# EasyEDA Pro project ProProject_MinSyBo_Star_2024-06-01.epro

# Schematic 原理图

## Sheets
1 P1: Create Date: 2024-05-13; Page Name: P1; Project Name: MinSyBo_Star; Schematic Name: 原理图; Update Date: 2024-05-19; Company: 嘉立创EDA; Drawed: DY; Page Size: A4; Version: V1.0
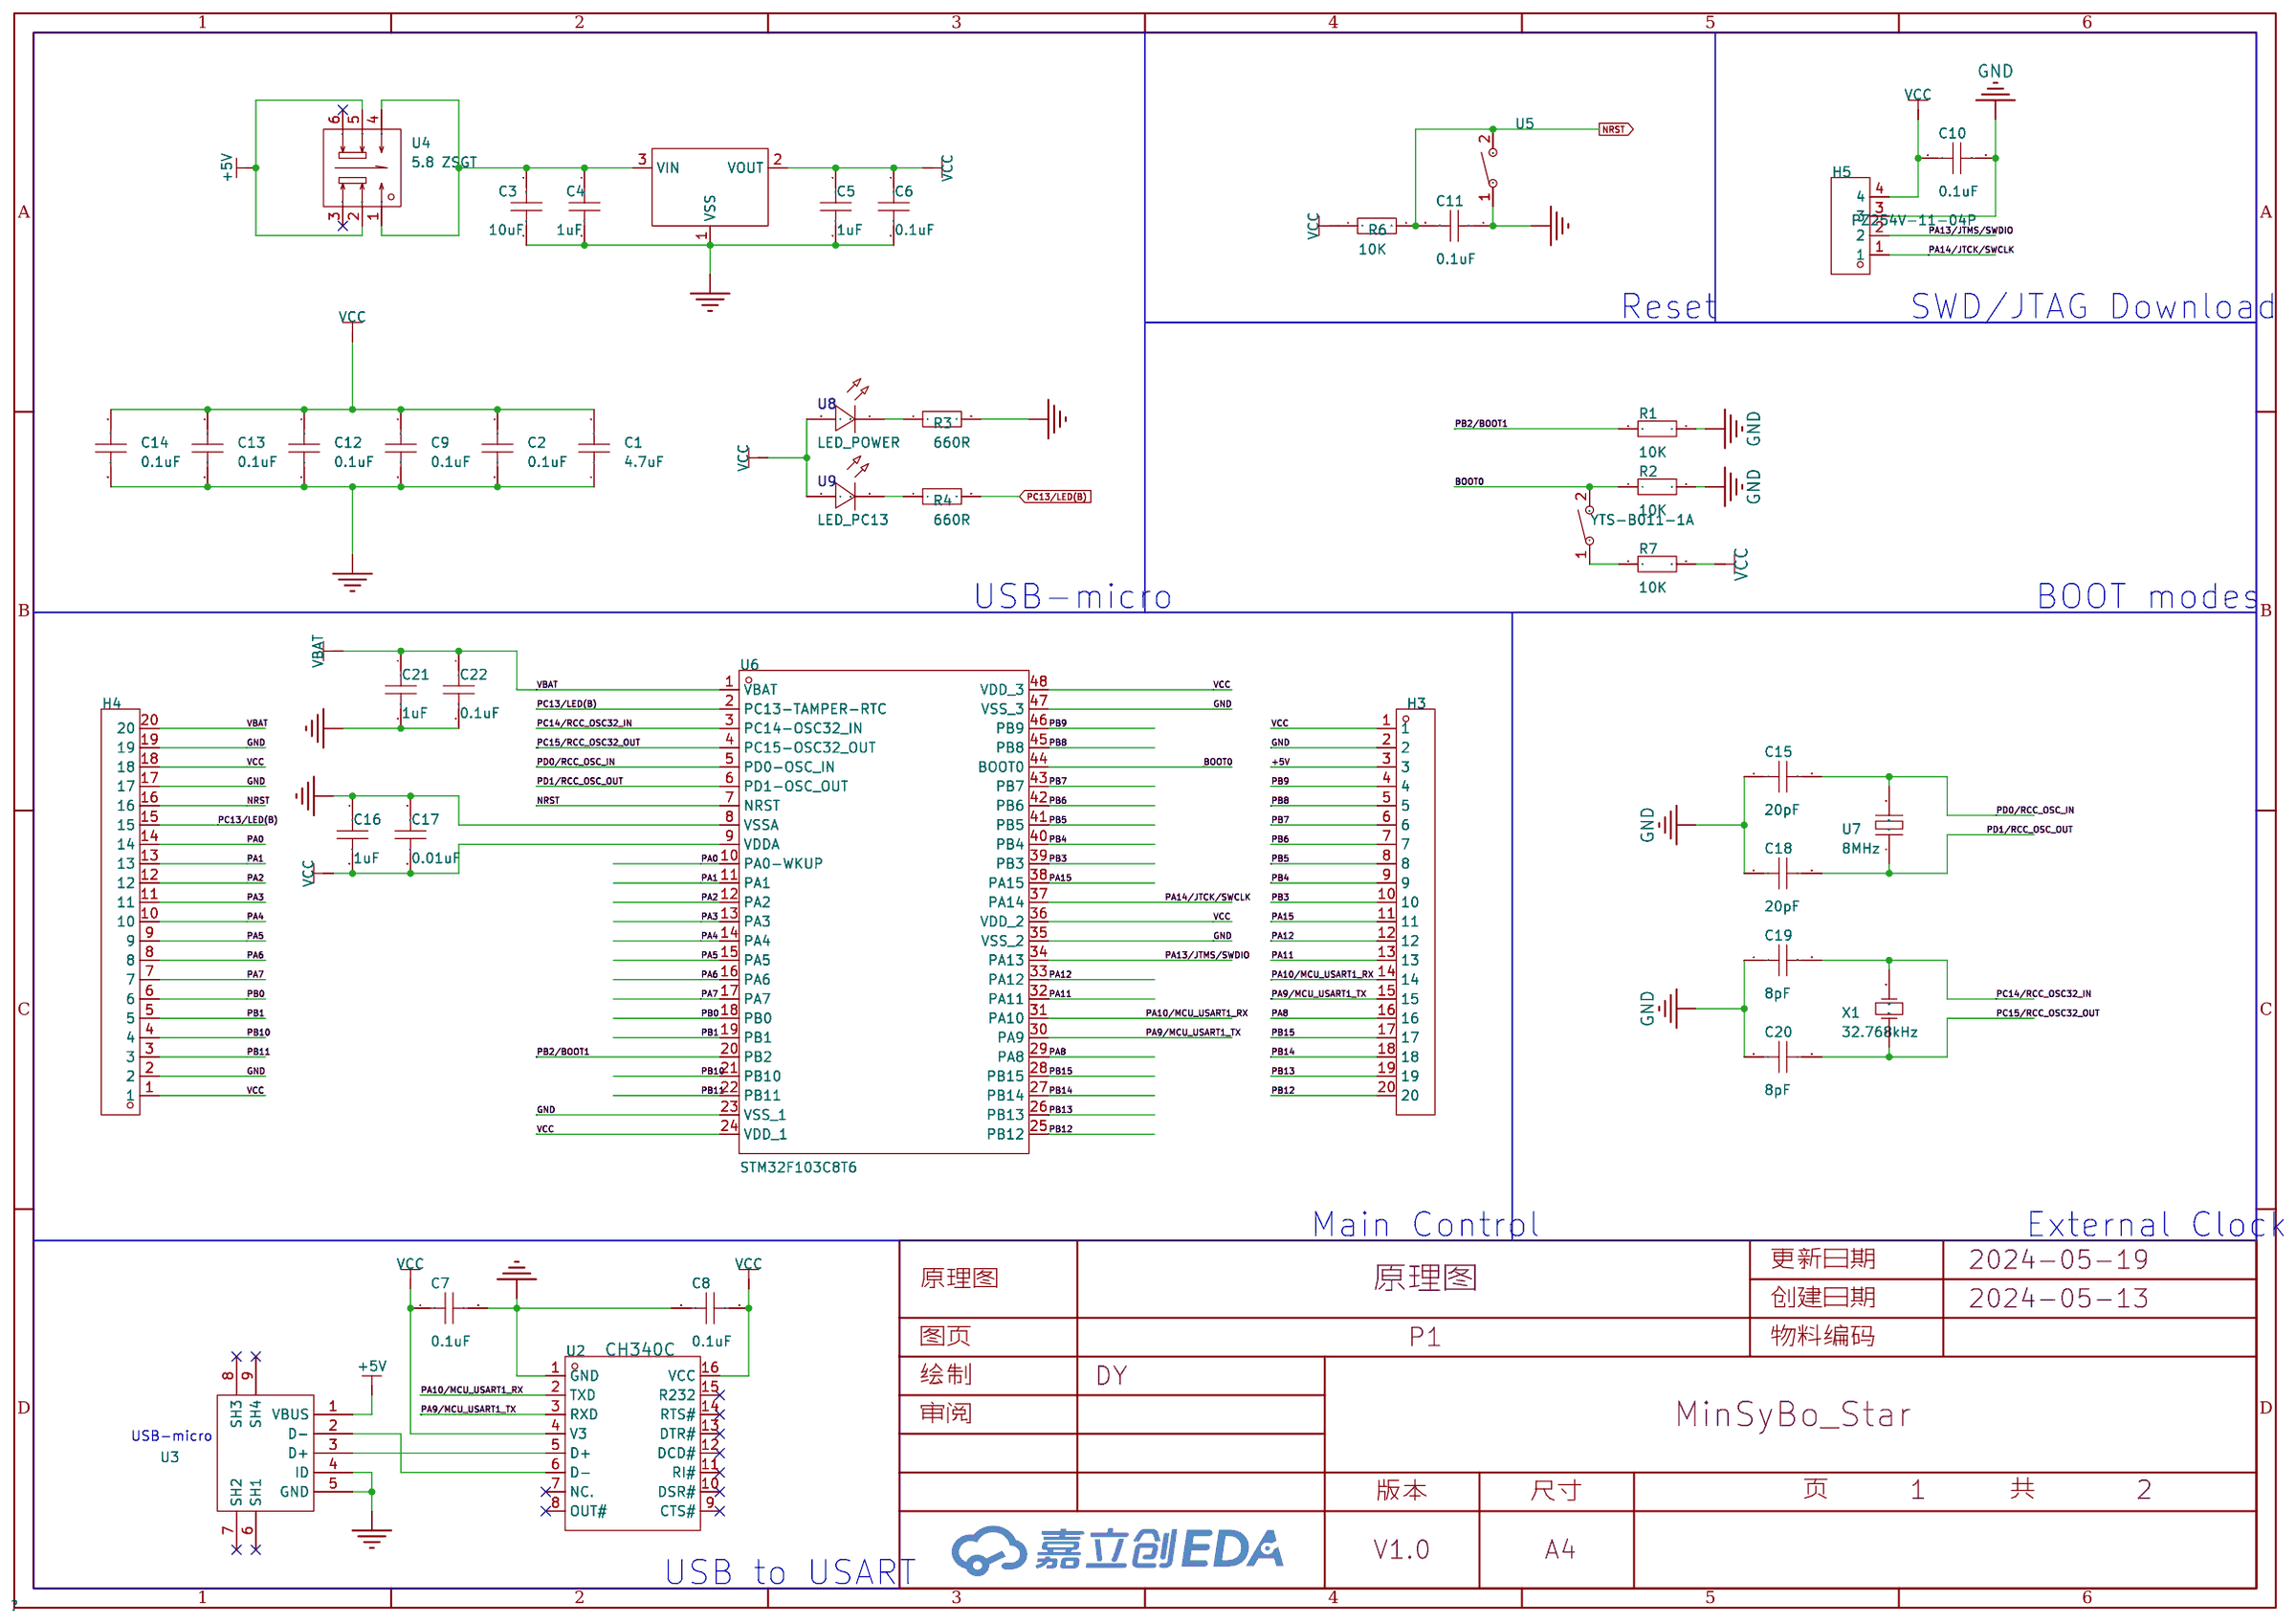
[diagram p0: P1]
2 杂七杂八: Create Date: 2024-05-19; Page Name: 杂七杂八
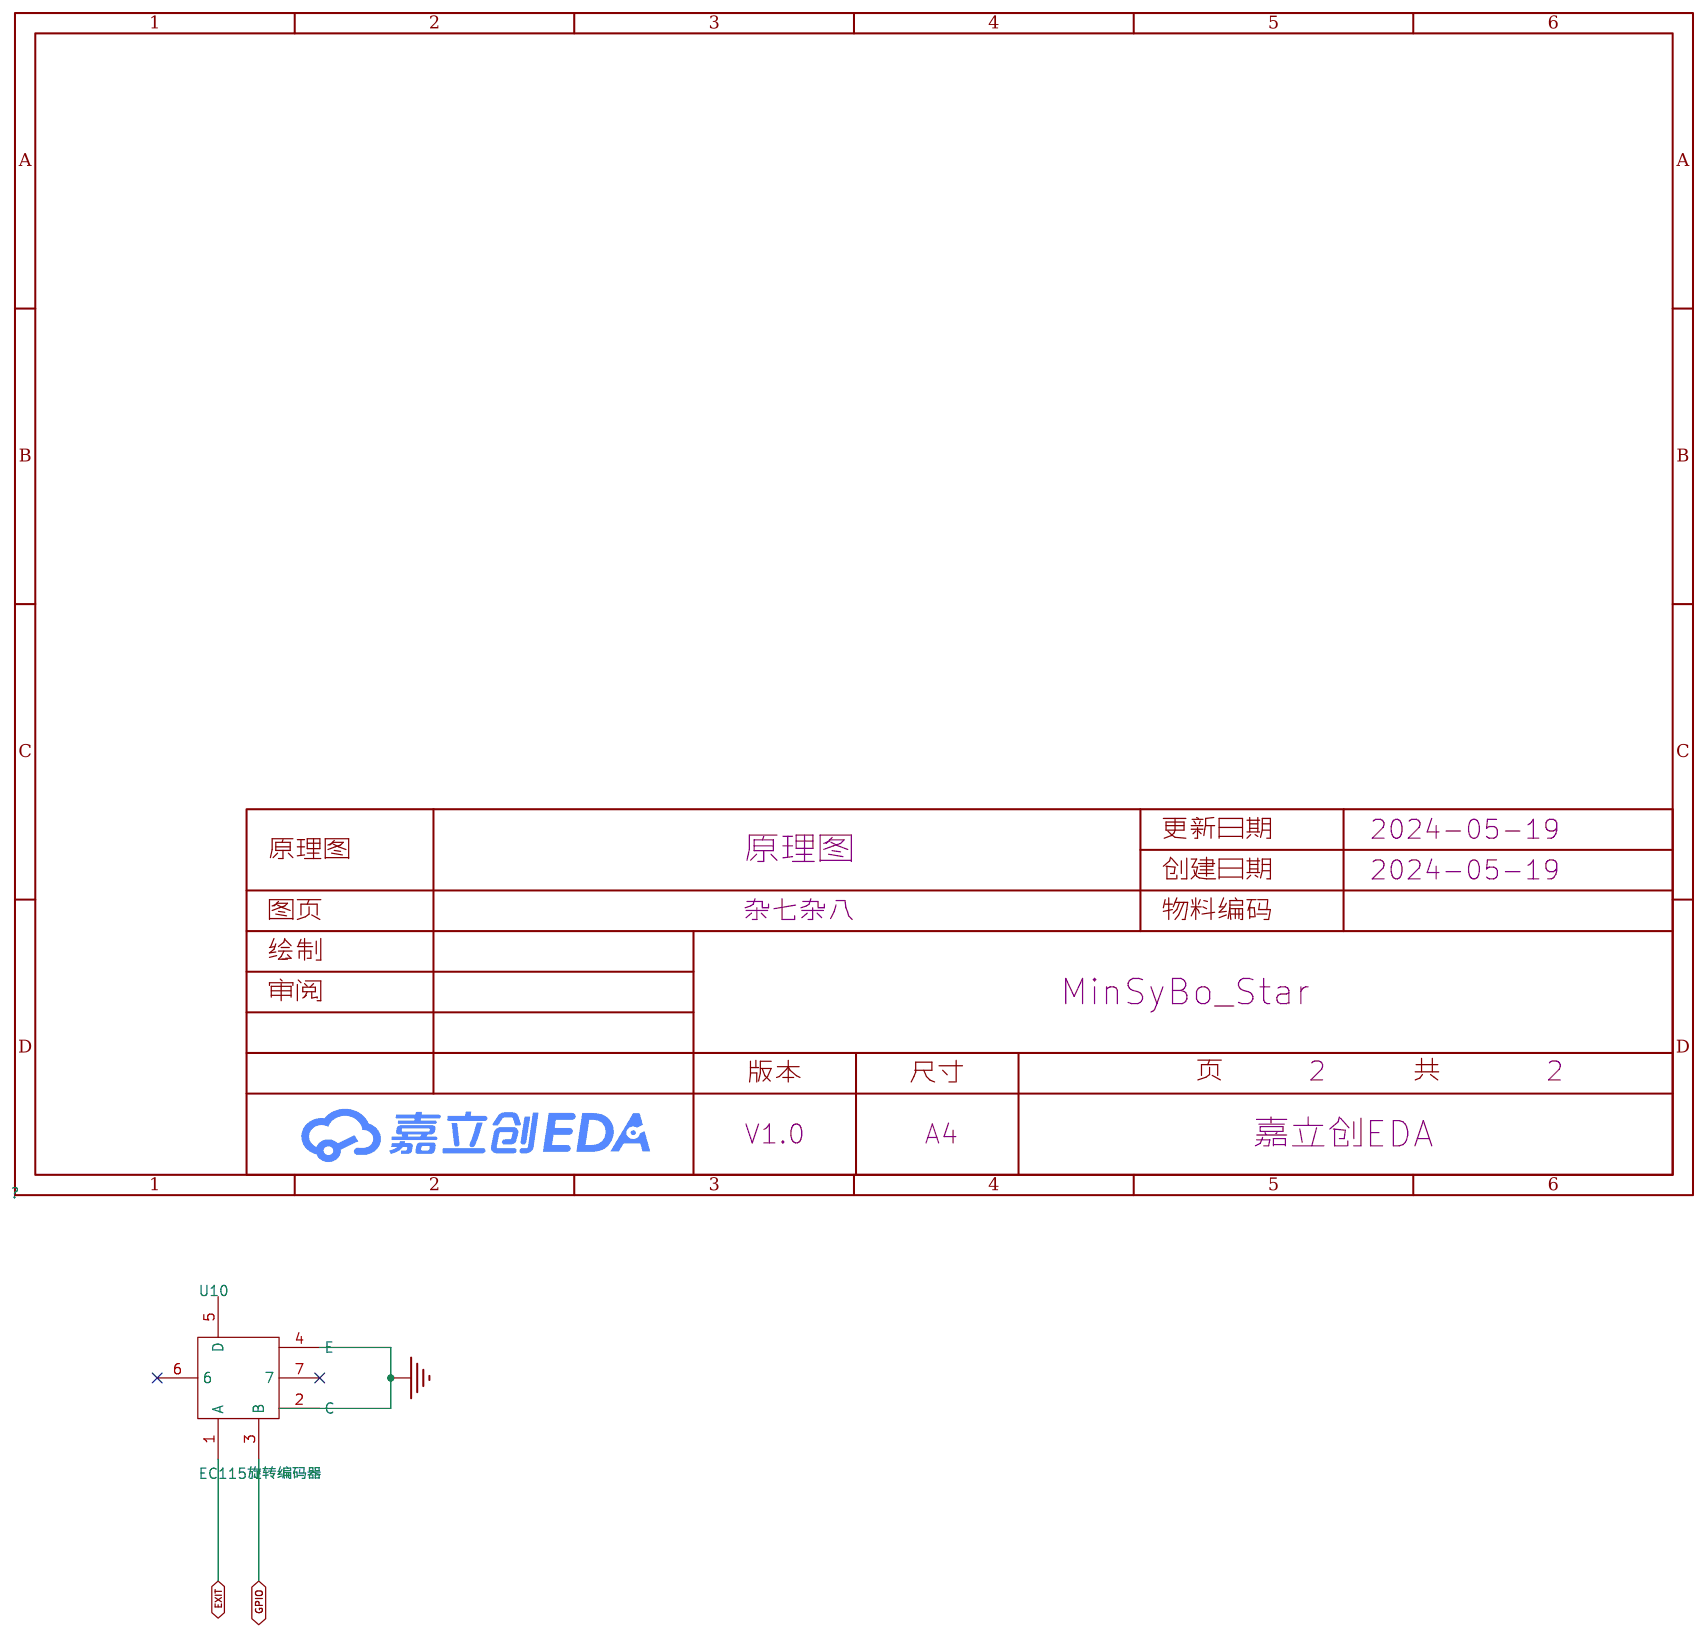
[diagram p1: 杂七杂八]

## Parts
sheet P1
BOOT0  YTS-B011-1A  [SW-TH_L6.1-W3.5-P6.60-LS8.0]
C1  4.7uF  [C0603]
C2  100nF  [C0603]
C3  10uF  [C0603]
C4  1uF  [C0603]
C5  1uF  [C0603]
C6  0.1uF  [C0603]
C7  0.1uF  [C0603]
C8  0.1uF  [C0603]
C9  100nF  [C0603]
C10  0.1uF  [C0603]
C11  0.1uF  [C0603]
C12  100nF  [C0603]
C13  100nF  [C0603]
C14  100nF  [C0603]
C15  20pF  [C0603]
C16  1uF  [C0603]
C17  0.01uF  [C0603]
C18  20pF  [C0603]
C19  8pF  [C0603]
C20  8pF  [C0603]
C21  1uF  [C0603]
C22  0.1uF  [C0603]
H3  2.54-1*20P直针  [HDR-TH_20P-P2.54-V-M-1]
H4  2.54-1*20P直针  [HDR-TH_20P-P2.54-V-M-1]
H5  PZ254V-11-04P  [HDR-TH_4P-P2.54-V-M]
R1  10K  [R0603]
R2  10K  [R0603]
R3  660R  [R0603]
R4  660R  [R0603]
R6  10K  [R0603]
R7  10K  [R0603]
U1  XC6206P332MR  [SOT-23-3_L2.9-W1.3-P1.90-LS2.4-BR]
U2  CH340C  [SOP-16_L10.0-W3.9-P1.27-LS6.0-BL]
U3  MicroXNJ  [MICRO-USB-SMD_MICROXNJ]
U4  5.8 ZSGT  [SW-TH_5.8ZSGT]
U5  YTS-B011-1A  [SW-TH_L6.1-W3.5-P6.60-LS8.0]
U6  STM32F103C8T6  [LQFP-48_L7.0-W7.0-P0.50-LS9.0-BL]
U7  8MHz  [HC-49SMD_L11.1-W4.8]
U8  LED_POWER  [LED_0603]
U9  LED_PC13  [LED_0603]
X1  32.768kHz  [OSC-TH_BD3.8-P0.50]
sheet 杂七杂八
U10  EC115旋转编码器  [SW-SMD_EC115_C9900036245]

## Library data of the parts
BOOT0 = YTS-B011-1A: 电路结构:单刀单掷;按钮形状:矩形按钮;作用力:160gf;安装方式:直插;开关长度:6.1mm;开关宽度:3.5mm;开关高度:4.3mm;带支架:不带;触点电流:50mA;额定电压(DC):12V;绝缘电阻:100MΩ;机械寿命:2万次;; LCSC Part Name: 6.1*3.5*4.3mm 直插 轻触开关; Supplier Part: C2910713; Manufacturer: YIYUAN(怡远); Supplier Footprint: 插件; JLCPCB Part Class: Extended Part; Datasheet: https://atta.szlcsc.com/upload/public/pdf/source/20211129/E22FC470A581AB3D8D68C2E6E06A2474.pdf; Supplier: LCSC; Circuit: 单刀单掷; Actuator Style: 矩形按钮; Operating Force: 160gf; Mounting Style: 直插; Switch Length: 6.1mm; Switch Width: 3.5mm; Switch Height: 4.3mm; Strike Gundam: 不带; Contact Current: 50mA; Voltage Rating (DC): 12V; Insulation Resistance: 100MΩ; Actuator/Cap Color: 白色; Pin Style: PC引脚; Mechanical Life: 2万次; With Lamp: 无; Operating Temperature: -30℃~+85℃
C1 C2 C4-C22 = CAP_0603: Supplier Footprint: 0603; Standardization Check: false; Supplier Part: C14663
C3 = CL10A106KP8NNNC: 容值:10uF;精度:±10%;额定电压:10V;材质(温度系数):X5R;; LCSC Part Name: 10uF ±10% 10V; Supplier Part: C14663; Manufacturer: SAMSUNG(三星); Supplier Footprint: 0603; JLCPCB Part Class: Basic Part; Datasheet: https://atta.szlcsc.com/upload/public/pdf/source/20160218/1457707763339.pdf; Supplier: LCSC; Tolerance: ±10%; Voltage Rated: 10V; Temperature Coefficient: X5R
H3 H4 = 2.54-1*20P直针: 插针结构:1x20P;间距:2.54mm;行距:-;圆针/方针:方针;安装类型:直插;排数:单排;总PIN位数:20P;额定电流:3A;额定电压:-;配合针长度:-;塑高:-;端接针长度:-;触头材质:黄铜;触头镀层:-;工作温度范围:-40℃~+105℃;颜色:黑色;; LCSC Part Name: 间距:2.54mm 1x20P 直插 方针; Supplier Part: C50981; Manufacturer: BOOMELE(博穆精密); Supplier Footprint: 插件,P=2.54mm; JLCPCB Part Class: Extended Part; Datasheet: https://atta.szlcsc.com/upload/public/pdf/source/20151109/1457707572883.pdf; Supplier: LCSC; Pin Structure: 1x20P; Pitch: 2.54mm; Circluar Pins/Square Pins: 方针; Mounting Type: 直插; Number of Rows: 单排; Number of Pins: 20P; Current Rating (Max): 3A; Contact Material: 黄铜; Operating Temperature Range: -40℃~+105℃; Color: 黑色
H5 = PZ254V-11-04P_C492403: 插针结构:1x4P;间距:2.54mm;行距:-;圆针/方针:方针;安装类型:直插;排数:单排;总PIN位数:4P;额定电流:-;额定电压:-;配合针长度:6mm;塑高:2.5mm;端接针长度:3mm;触头材质:黄铜;触头镀层:-;工作温度范围:-40℃~+105℃;颜色:黑色;; LCSC Part Name: 间距:2.54mm 1x4P 直插 方针; Supplier Part: C492403; Manufacturer: XFCN(兴飞); Supplier Footprint: 插件,P=2.54mm; JLCPCB Part Class: Extended Part; Datasheet: https://atta.szlcsc.com/upload/public/pdf/source/20200309/C492403_F9F19131791D08044AD4F84F8E751A34.pdf; Supplier: LCSC; Pin Structure: 1x4P; Pitch: 2.54mm; Circluar Pins/Square Pins: 方针; Mounting Type: 直插; Number of Rows: 单排; Number of Pins: 4P; Length of Mating Pin: 6mm; Insulation Height: 2.5mm; Length of End Connection Pin: 3mm; Contact Material: 黄铜; Operating Temperature Range: -40℃~+105℃; Color: 黑色
R1 R2 R6 R7 = Res_0603: Supplier Footprint: 0603; Standardization Check: false; Supplier Part: C23025
R3 R4 = Res_0603: Supplier Footprint: 0603; Supplier Part: C23025
U1 = XC6206P332MR_C5148692: 输出类型:固定;最大输入电压:8V;输出电压:3.3V;最大输出电流:300mA;输出极性:正极;; LCSC Part Name: 输入8V 输出3.3V 300mA; Supplier Part: C5148692; Manufacturer: HXY MOSFET(华轩阳电子); Supplier Footprint: SOT-23; JLCPCB Part Class: 扩展库; Datasheet: https://atta.szlcsc.com/upload/public/pdf/source/20230315/7D5B35EFFBBF81C2EFC36318D2A1A670.pdf; Supplier: LCSC; Output Type: 固定; Maximum Input Voltage: 8V; Output Voltage: 3.3V; MAX Output Current: 300mA; Dropout Voltage: 240mV@(50mA); Output Polarity: 正极; Number of Outputs: 1
U2 = CH340C: 应用功能:收发器;接口协议:USB 2.0;数据速率:2Mbps;; LCSC Part Name: CH340C USB转串口芯片 CH340; Supplier Part: C84681; Manufacturer: WCH(南京沁恒); Supplier Footprint: SOP-16; Datasheet: https://atta.szlcsc.com/upload/public/pdf/source/20200819/C84681_ADBED554CE321879DBD6B1D06488689C.pdf; Supplier: LCSC; Applications Function: 收发器; Protocol: USB 2.0; Supply Voltage: 3.3V；5V; Data Rate: 2Mbps
U3 = MicroXNJ: 连接器类型:Micro-B;标准:USB 2.0;公母:母;端口数量:1;触点数量:5P;安装方式:卧贴;额定电流 - 电源:1A;工作温度范围:-20℃~+85℃;; LCSC Part Name: Micro-B 母 卧贴; Supplier Part: C404969; Manufacturer: SHOU HAN(首韩); Supplier Footprint: SMD; JLCPCB Part Class: Extended Part; Datasheet: https://atta.szlcsc.com/upload/public/pdf/source/20220415/2494EDFF499AF6F852F7C820374B6AF3.pdf; Supplier: LCSC; Connector Type: Micro-B; Standard: USB 2.0; Gender: 母; Number of Ports: 1; Number of Contacts: 5P; Mounting Style: 卧贴; Current Rating - Power (Max): 1A; Operating Temperature Range: -20℃~+85℃
U4 = 5.8 ZSGT: 电路结构:双刀双掷;自锁/无锁:自锁;安装方式:直插;触点电流:110mA;额定电压 (DC):30V;带灯:不带;作用力:150gf;机械寿命:10万次;; LCSC Part Name: 5.8*5.8有头/高头 带锁/自锁开关 泡泡机开关; Supplier Part: C2681587; Manufacturer: SHOU HAN(首韩); Supplier Footprint: 插件; JLCPCB Part Class: 扩展库; Datasheet: https://atta.szlcsc.com/upload/public/pdf/source/20210107/C2681587_CDDDDA4A1C7AC9FEB01815B75893A6BA.pdf; Supplier: LCSC; Circuit: 双刀双掷; Self Lock / No Lock: 自锁; Actuator Style: 方形按钮; Mounting Style: 直插; Contact Current: 110mA; Voltage Rating (DC): 30V; Insulation Resistance: 100MΩ; Actuator/Cap Color: 白色; With Lamp: 不带; Pin Style: PC引脚; Operating Force: 150gf; Operating Temperature: -10℃~+70℃; Mechanical Life: 10万次
U5 = YTS-B011-1A: 电路结构:单刀单掷;按钮形状:矩形按钮;作用力:160gf;安装方式:直插;开关长度:6.1mm;开关宽度:3.5mm;开关高度:4.3mm;带支架:不带;触点电流:50mA;额定电压(DC):12V;绝缘电阻:100MΩ;机械寿命:2万次;; LCSC Part Name: 6.1*3.5*4.3mm 直插 轻触开关; Supplier Part: C2910713; Manufacturer: YIYUAN(怡远); Supplier Footprint: 插件; JLCPCB Part Class: Extended Part; Datasheet: https://atta.szlcsc.com/upload/public/pdf/source/20211129/E22FC470A581AB3D8D68C2E6E06A2474.pdf; Supplier: LCSC; Circuit: 单刀单掷; Actuator Style: 矩形按钮; Operating Force: 160gf; Mounting Style: 直插; Switch Length: 6.1mm; Switch Width: 3.5mm; Switch Height: 4.3mm; Strike Gundam: 不带; Contact Current: 50mA; Voltage Rating (DC): 12V; Insulation Resistance: 100MΩ; Actuator/Cap Color: 白色; Pin Style: PC引脚; Mechanical Life: 2万次
U6 = STM32F103C8T6: CPU内核:ARM-M3;程序存储容量:64KB;RAM总容量:20KB;GPIO端口数量:37;工作电压范围:2V~3.6V;CPU最大主频:72MHz;程序存储器类型:FLASH;; Supplier Part: C8734; Manufacturer: ST(意法半导体); Supplier Footprint: LQFP-48(7x7); JLCPCB Part Class: 扩展库; Datasheet: https://atta.szlcsc.com/upload/public/pdf/source/20220812/8363ACEC51AD55ECEB84799464F7CB85.pdf; Supplier: LCSC; CPU Core: ARM-M3; Program Storage Size: 64KB; RAM Size: 20KB; GPIO Ports Number: 37; Operating Voltage Range: 2V~3.6V; CPU Maximum Speed: 72MHz; Program Memory Type: FLASH; Operating Temperature Range: -40℃~+85℃; ADC (Bit): 12bit; Universal Serial Bus: 有; Peripheral/Function: 看门狗；DMA；看门狗；温度传感器; Watchdog: 有; Infrared Data Association: 有; Low-Voltage Detect: 有; Direct Memory Access: 有; Internal Oscillator: 有
U7 = RC08000619: 晶振类型:贴片晶振;频率:8MHz;常温频差:±10ppm;外接负载电容:20pF;频率稳定度(全温):±30ppm;; LCSC Part Name: 8MHz ±10ppm 20pF; Supplier Part: C19173024; Manufacturer: TROQ(创捷); Supplier Footprint: HC-49S-SMD; Datasheet: https://atta.szlcsc.com/upload/public/pdf/source/20231030/EE638514B404DA0C4D347D745AEBACA1.pdf; Supplier: LCSC; Crystal Type: 贴片晶振; Normal temperature Frequency Tolerance: ±10ppm; External load capacitor: 20pF; Frequency Stability(Full temperature range): ±30ppm; Operating Temperature: -40℃~+85℃
U8 = LED_0603-G: Supplier Footprint: 0603; Supplier Part: C965799
U9 = LED_0603-B: Supplier Footprint: 0603; Supplier Part: C965799
X1 = K383276812520: 晶振类型:直插晶振;频率:32.768kHz;常温频差:±20ppm;外接负载电容:12.5pF;频率稳定度(全温):±20ppm;; LCSC Part Name: 32.768kHz ±20ppm 12.5pF; Supplier Part: C368795; Manufacturer: KYX(凯越翔); Supplier Footprint: DT-38; Datasheet: https://atta.szlcsc.com/upload/public/pdf/source/20190218/C368795_B0303523B118954B279FF456DC2D6212.pdf; Supplier: LCSC; Crystal Type: 直插晶振; Normal temperature Frequency Tolerance: ±20ppm; External load capacitor: 12.5pF; Frequency Stability(Full temperature range): ±20ppm; Equivalent Series Resistance (ESR): 70kΩ; Operating Temperature: -20℃~+70℃
U10 = EC115旋转编码器: Supplier Part: C9900036245; Supplier Footprint: SMD; JLCPCB Part Class: 扩展库; Supplier: LCSC

## Nets
+5V: H3.3 U3.1(VBUS) U4.2 U4.5
GND: C1.1 C2.2 C3.2 C4.2 C5.2 C6.2 C7.2 C8.1 C9.2 C10.2 C11.1 C12.2 C13.2 C14.2 C15.1 C16.1 C17.1 C18.1 C19.1 C20.1 C21.2 C22.2 H3.2 H4.2 H4.17 H4.19 H5.3 R1.1 R2.2 R3.2 U1.1(VSS) U2.1(GND) U3.4(ID) U3.5(GND) U5.1 U6.8(VSSA) U6.23(VSS_1) U6.35(VSS_2) U6.47(VSS_3) U10.2(C)
VBAT: C21.1 C22.1 H4.20 U6.1(VBAT)
VCC: C1.2 C2.1 C5.1 C6.1 C7.1 C8.2 C9.1 C10.1 C12.1 C13.1 C14.1 C16.2 C17.2 H3.1 H4.1 H4.18 H5.4 R6.1 R7.2 U1.2(VOUT) U2.4(V3) U2.16(VCC) U6.9(VDDA) U6.24(VDD_1) U6.36(VDD_2) U6.48(VDD_3) U8.2(A) U9.2(A)
BOOT0: BOOT0.2 R2.1 U6.44(BOOT0)
EXIT: U10.1(A)
GPIO: U10.3(B)
NRST: C11.2 H4.16 R6.2 U5.2 U6.7(NRST)
PA0: H4.14 U6.10(PA0-WKUP)
PA1: H4.13 U6.11(PA1)
PA2: H4.12 U6.12(PA2)
PA3: H4.11 U6.13(PA3)
PA4: H4.10 U6.14(PA4)
PA5: H4.9 U6.15(PA5)
PA6: H4.8 U6.16(PA6)
PA7: H4.7 U6.17(PA7)
PA8: H3.16 U6.29(PA8)
PA9/MCU_USART1_TX: H3.15 U2.3(RXD) U6.30(PA9)
PA10/MCU_USART1_RX: H3.14 U2.2(TXD) U6.31(PA10)
PA11: H3.13 U6.32(PA11)
PA12: H3.12 U6.33(PA12)
PA13/JTMS/SWDIO: H5.2 U6.34(PA13)
PA14/JTCK/SWCLK: H5.1 U6.37(PA14)
PA15: H3.11 U6.38(PA15)
PB0: H4.6 U6.18(PB0)
PB1: H4.5 U6.19(PB1)
PB2/BOOT1: R1.2 U6.20(PB2)
PB3: H3.10 U6.39(PB3)
PB4: H3.9 U6.40(PB4)
PB5: H3.8 U6.41(PB5)
PB6: H3.7 U6.42(PB6)
PB7: H3.6 U6.43(PB7)
PB8: H3.5 U6.45(PB8)
PB9: H3.4 U6.46(PB9)
PB10: H4.4 U6.21(PB10)
PB11: H4.3 U6.22(PB11)
PB12: H3.20 U6.25(PB12)
PB13: H3.19 U6.26(PB13)
PB14: H3.18 U6.27(PB14)
PB15: H3.17 U6.28(PB15)
PC13/LED(B): H4.15 R4.2 U6.2(PC13-TAMPER-RTC)
PC14/RCC_OSC32_IN: C19.2 U6.3(PC14-OSC32_IN) X1.2(OSC2)
PC15/RCC_OSC32_OUT: C20.2 U6.4(PC15-OSC32_OUT) X1.1(OSC1)
PD0/RCC_OSC_IN: C15.2 U6.5(PD0-OSC_IN) U7.2(GND)
PD1/RCC_OSC_OUT: C18.2 U6.6(PD1-OSC_OUT) U7.1
$1N7601: R3.1 U8.1(C)
$1N7627: R4.1 U9.1(C)
$1N8327: U2.5(D+) U3.3(D+)
$1N8354: U2.6(D-) U3.2(D-)
$1N13397: BOOT0.1 R7.1
$1N13854: C3.1 C4.1 U1.3(VIN) U4.1 U4.4

Not connected (* = marked no-connect by the designer): U2 7(NC.)* 8(OUT#)* 9(CTS#)* 10(DSR#)* 11(RI#)* 12(DCD#)* 13(DTR#)* 14(RTS#)* 15(R232)*; U3 6(SH1)* 7(SH2)* 8(SH3)* 9(SH4)*; U4 3* 6*; U10 4(E) 5(D) 6* 7*

## Notes on the sheets
sheet 1
- Reset
- SWD/JTAG Download
- USB-micro
- BOOT modes
- Main Control
- External Clock
- USB-micro
- USB to USART

# Board MinSyBoStar
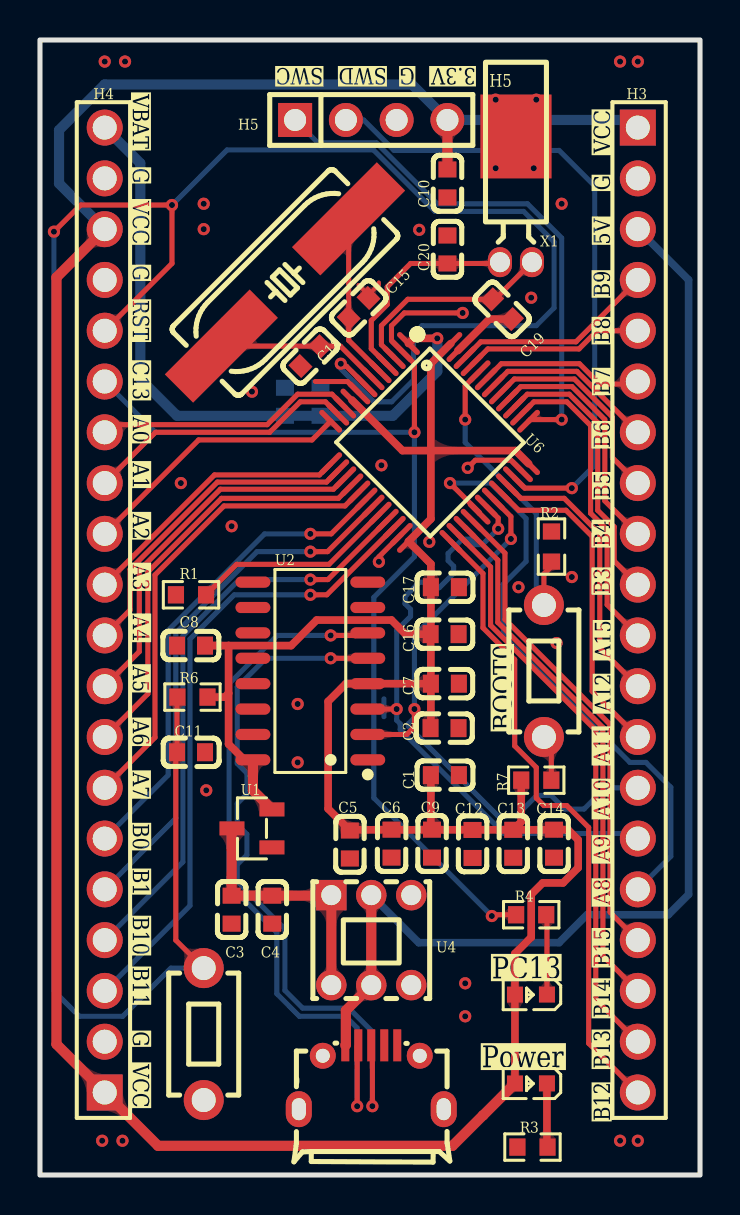
[diagram p2: board, top side]
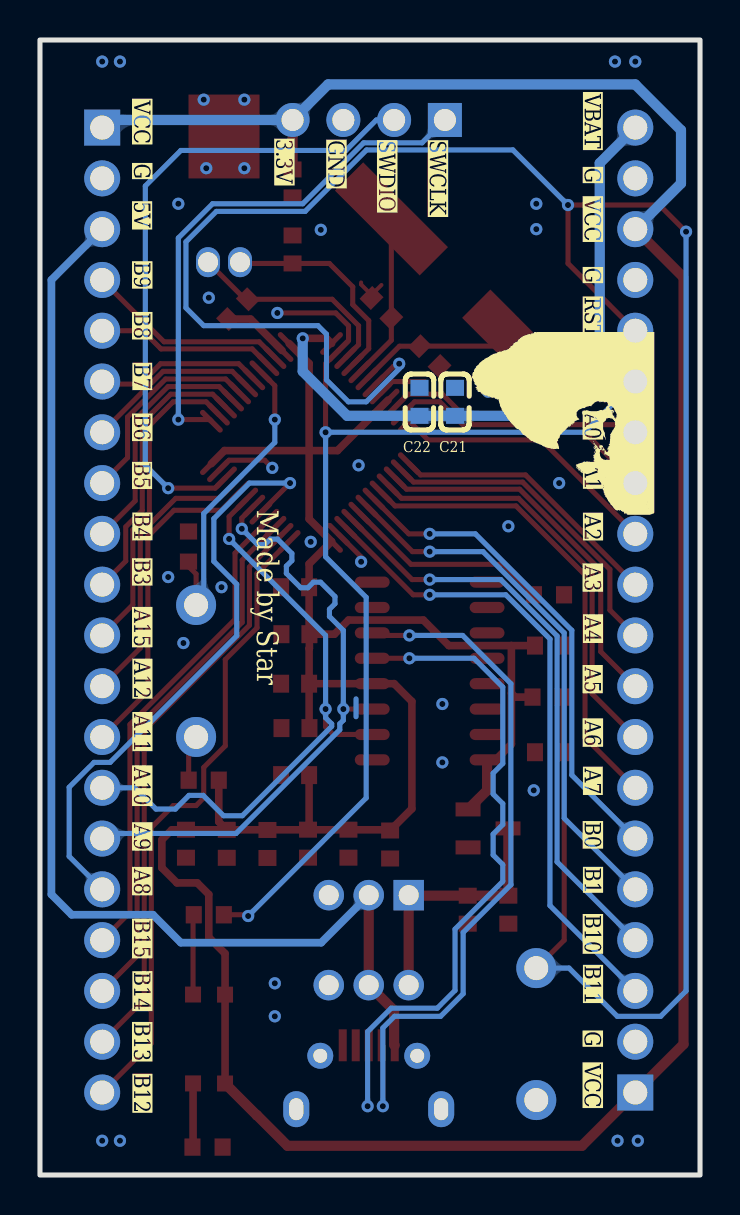
[diagram p3: board, bottom side, seen from below]

Outline 33.02 x 56.77 mm; copper layers: Top Layer, Bottom Layer. Coordinates in mm from the lower left corner of the outline.
Outline path: rectangle 33.02,0 0,56.77
Stack: Top Layer 0.035mm / Dielectric1 1.51mm FR4 er 4.5 / Bottom Layer 0.035mm

## Design rules (mm)
net PC14/RCC_OSC32_IN: DP4
net PC15/RCC_OSC32_OUT: DP4
net PD0/RCC_OSC_IN: DP3
net PD1/RCC_OSC_OUT: DP3
net PA9/MCU_USART1_TX: DP2
net PA10/MCU_USART1_RX: DP2
net $1N8327: DP1
net $1N8354: DP1
template: JLCPCB Capability(Two Layers Board)
spacing copperThickness1oz (default): track to track 0.102, other pairs 0.152 to 0.3
spacing copperThickness2oz: track to track 0.203, other pairs 0.152 to 0.3
track width copperThickness1oz (default): min 0.127, default 0.254, max 2.54
track width copperThickness2oz: min 0.203, default 0.254, max 2.54
differential pair differentialPair (default): width min 0.127, default 0.254, max 2.54; gap min 0.152, default 0.152
via viaSize (default): diameter min 0.5, default 0.61, max 10; hole min 0.3, default 0.305, max 6.3

## Placement (name value [footprint] x y rotation side)
BOOT0  YTS-B011-1A  [SW-TH_L6.1-W3.5-P6.60-LS8.0]  25.21 25.21 90 top
C1  4.7uF  [C0603]  20.26 20 180 top
C2  100nF  [C0603]  20.24 22.35 0 top
C3  10uF  [C0603]  9.59 13.27 270 top
C4  1uF  [C0603]  11.62 13.27 270 top
C5  1uF  [C0603]  15.5 16.53 270 top
C6  0.1uF  [C0603]  17.59 16.57 270 top
C7  0.1uF  [C0603]  20.26 24.57 0 top
C8  0.1uF  [C0603]  7.56 26.48 0 top
C9  100nF  [C0603]  19.61 16.57 270 top
C10  0.1uF  [C0603]  20.38 49.59 270 top
C11  0.1uF  [C0603]  7.56 21.15 180 top
C12  100nF  [C0603]  21.64 16.56 270 top
C13  100nF  [C0603]  23.68 16.57 270 top
C14  100nF  [C0603]  25.72 16.57 270 top
C15  20pF  [C0603]  15.94 43.37 225 top
C16  1uF  [C0603]  20.24 27.05 180 top
C17  0.01uF  [C0603]  20.26 29.4 180 top
C18  20pF  [C0603]  13.53 40.96 45 top
C19  8pF  [C0603]  23.12 43.31 135 top
C20  8pF  [C0603]  20.38 46.29 270 top
C21  1uF  [C0603]  12.26 38.67 90 bottom
C22  0.1uF  [C0603]  14.03 38.67 90 bottom
H3  2.54-1*20P直针  [HDR-TH_20P-P2.54-V-M-1]  29.91 28.26 270 top
H4  2.54-1*20P直针  [HDR-TH_20P-P2.54-V-M-1]  3.24 28.26 90 top
H5  PZ254V-11-04P  [HDR-TH_4P-P2.54-V-M]  16.57 52.77 0 top
NOREF  -  [Pad_e86686]  23.81 51.94 0 top
R1  10K  [R0603]  7.56 29.02 0 top
R2  10K  [R0603]  25.59 31.43 90 top
R3  660R  [R0603]  24.64 1.4 180 top
R4  660R  [R0603]  24.57 13.02 180 top
R6  10K  [R0603]  7.63 23.9 180 top
R7  10K  [R0603]  24.83 19.75 180 top
U1  XC6206P332MR  [SOT-23-3_L2.9-W1.3-P1.90-LS2.4-BR]  10.6 17.34 0 top
U2  CH340C  [SOP-16_L10.0-W3.9-P1.27-LS6.0-BL]  13.53 25.21 90 top
U3  MicroXNJ  [MICRO-USB-SMD_MICROXNJ]  16.57 4.89 0 top
U4  5.8 ZSGT  [SW-TH_5.8ZSGT]  16.57 11.75 180 top
U5  YTS-B011-1A  [SW-TH_L6.1-W3.5-P6.60-LS8.0]  8.19 7.05 270 top
U6  STM32F103C8T6  [LQFP-48_L7.0-W7.0-P0.50-LS9.0-BL]  19.49 36.64 225 top
U7  8MHz  [HC-49SMD_L11.1-W4.8]  12.26 44.64 45 top
U8  LED_POWER  [LED_0603]  24.51 4.57 180 top
U9  LED_PC13  [LED_0603]  24.51 9.02 180 top
X1  32.768kHz  [OSC-TH_BD3.8-P0.50]  23.81 45.66 0 top

## Footprints (pads in the part's own frame, mm; a bottom-side part is the same pattern mirrored in y, then rotated)
C0603
  rect 0.8x0.9 smd: 1(-0.7,0) 2(0.7,0)
HC-49SMD_L11.1-W4.8
  rect 6x2 smd: 1(-4.5,0) 2(4.5,0)
HDR-TH_4P-P2.54-V-M
  rect 1.7x1.7 hole 1.1: 1(-3.81,0)
  round 1.7 hole 1.1: 2(-1.27,0) 3(1.27,0) 4(3.81,0)
HDR-TH_20P-P2.54-V-M-1
  rect 1.8x1.8 hole 1.2: 1(-24.13,0)
  round 1.8 hole 1.2: 2(-21.59,0) 3(-19.05,0) 4(-16.51,0) 5(-13.97,0) 6(-11.43,0) 7(-8.89,0) 8(-6.35,0) 9(-3.81,0) 10(-1.27,0) 11(1.27,0) 12(3.81,0) 13(6.35,0) 14(8.89,0) 15(11.43,0) 16(13.97,0) 17(16.51,0) 18(19.05,0) 19(21.59,0) 20(24.13,0)
LED_0603
  rect 0.8x0.8 smd: 1(-0.851,-0.01) 2(0.75,-0.005)
LQFP-48_L7.0-W7.0-P0.50-LS9.0-BL
  oval 0.27x1.5 smd: 1(-2.75,-4.25) 2(-2.25,-4.25) 3(-1.75,-4.25) 4(-1.25,-4.25) 5(-0.75,-4.25) 6(-0.25,-4.25) 7(0.25,-4.25) 8(0.75,-4.25) 9(1.25,-4.25) 10(1.75,-4.25) 11(2.25,-4.25) 12(2.75,-4.25) 25(2.75,4.25) 26(2.25,4.25) 27(1.75,4.25) 28(1.25,4.25) 29(0.75,4.25) 30(0.25,4.25) 31(-0.25,4.25) 32(-0.75,4.25) 33(-1.25,4.25) 34(-1.75,4.25) 35(-2.25,4.25) 36(-2.75,4.25)
  oval 1.5x0.27 smd: 13(4.25,-2.75) 14(4.25,-2.25) 15(4.25,-1.75) 16(4.25,-1.25) 17(4.25,-0.75) 18(4.25,-0.25) 19(4.25,0.25) 20(4.25,0.75) 21(4.25,1.25) 22(4.25,1.75) 23(4.25,2.25) 24(4.25,2.75) 37(-4.25,2.75) 38(-4.25,2.25) 39(-4.25,1.75) 40(-4.25,1.25) 41(-4.25,0.75) 42(-4.25,0.25) 43(-4.25,-0.25) 44(-4.25,-0.75) 45(-4.25,-1.25) 46(-4.25,-1.75) 47(-4.25,-2.25) 48(-4.25,-2.75)
MICRO-USB-SMD_MICROXNJ
  rect 0.4x1.6 smd: 1(-1.3,1.597) 2(-0.65,1.597) 3(0,1.597) 4(0.65,1.597) 5(1.3,1.597)
  round 1.3 hole 0.7: 6(2.425,1.074) 9(-2.425,1.073)
  oval 1.3x1.8 hole 0.7x1.1: 7(3.625,-1.597) 8(-3.625,-1.597)
OSC-TH_BD3.8-P0.50
  oval 1.2x1.5 hole 1: 1(-0.8,0) 2(0.8,0)
Pad_e86686
  custom 3.556x4.191 smd: 49(0,0)
R0603
  rect 0.806x0.864 smd: 1(-0.753,0) 2(0.753,0)
SOP-16_L10.0-W3.9-P1.27-LS6.0-BL
  oval 0.56x1.745 smd: 1(-4.445,-2.873) 2(-3.175,-2.873) 3(-1.905,-2.873) 4(-0.635,-2.873) 5(0.635,-2.873) 6(1.905,-2.873) 7(3.175,-2.873) 8(4.445,-2.873) 9(4.445,2.873) 10(3.175,2.873) 11(1.905,2.873) 12(0.635,2.873) 13(-0.635,2.873) 14(-1.905,2.873) 15(-3.175,2.873) 16(-4.445,2.873)
SOT-23-3_L2.9-W1.3-P1.90-LS2.4-BR
  rect 1.25x0.7 smd: 1(1,-0.95) 2(1,0.95) 3(-1,0)
SW-TH_5.8ZSGT
  rect 1.524x1.524 hole 1: 1(2,-2.25)
  round 1.524 hole 1: 2(0,-2.25) 3(-2,-2.25) 4(2,2.25) 5(0,2.25) 6(-2,2.25)
SW-TH_L6.1-W3.5-P6.60-LS8.0
  round 2 hole 1.2: 1(-3.3,0) 2(3.3,0)

## Nets
As in the schematic, except:
GND: C1.1 C2.2 C3.2 C4.2 C5.2 C6.2 C7.2 C8.1 C9.2 C10.2 C11.1 C12.2 C13.2 C14.2 C15.1 C16.1 C17.1 C18.1 C19.1 C20.1 C21.2 C22.2 H3.2 H4.2 H4.17 H4.19 H5.3 NOREF.49 R1.1 R2.2 R3.2 U1.1 U2.1 U3.4 U3.5 U5.2 U6.8 U6.23 U6.35 U6.47
NRST: C11.2 H4.16 R6.2 U5.1 U6.7

Pads without a net: U2 7 8 9 10 11 12 13 14 15; U3 6 7 8 9; U4 3 6

## Via types
v1: diameter 0.61, hole 0.305, Top Layer to Bottom Layer, 55 vias

## Routing (per net, layer and track width the routed paths; a pad name or vN(x,y) marks a point on that pad's centre or on a via; arc(x,y) is an arc through that point)
+5V: length 60.2
  Top Layer w0.508: U4.2 U4.5 15.3,8.23 15.3,6.52 U3.1
  Bottom Layer w0.381: H3.3 32.45,44.77 32.45,14.03 31.43,13.02 27.37,13.02 25.97,11.62 18.95,11.62 U4.2
GND: length 13.3
  Top Layer w0.203: C15.1 16.43,44.02 ; 16.43,44.02 16.95,44.54 16.95,44.64 ; 16.43,44.02 15.94,44.51
  Top Layer w0.254: v1(21.4,35.37) 21.78,35.75 23.57,35.75 U6.35 ; 15.96,39.11 15.39,39.69 13.78,39.69 ; U6.23 16.95,30.92 v1(16.95,30.67)
  Top Layer w0.381: C19.1 22.48,42.81 U6.47
  Bottom Layer w0.254: 17.21,23.81 17.21,22.92
  vias: v1(3.11,1.71) v1(3.24,55.69) v1(4.13,1.71) v1(4.25,55.69) v1(7.05,34.61) v1(8.19,48.58) v1(8.19,47.31) v1(8.32,19.24) v1(9.59,32.45) v1(10.6,39.18) v1(12.89,23.56) v1(12.89,20.64) v1(17.08,35.5) v1(18.97,47.27) v1(19.48,31.67) v1(21.27,9.59) v1(21.27,7.94) v1(22.8,53.78) v1(22.8,50.36) v1(23.94,29.4) v1(24.57,43.88) v1(24.7,50.36) v1(24.83,53.78) v1(25.84,26.61) v1(26.1,48.58) v1(26.61,29.91) v1(29.02,55.69) v1(29.02,1.71) v1(29.91,55.69) v1(29.91,1.71)
VBAT: length 33.1
  Top Layer w0.381: v1(19.88,41.85) 18.69,41.85 18.43,41.59
  Bottom Layer w0.508: v1(19.88,41.85) 19.88,40.2 17.65,37.97 C22.1 C21.1 6.86,37.97 5.02,39.81 5.02,50.61 H4.20
VCC: length 204.2
  Top Layer w0.381: C7.1 19.56,26.33 19.54,26.35 19.54,27.05 ; C7.1 U2.4 15.3,24.57 14.41,23.69 14.41,18.32 C5.1 15.54,17.27 23.68,17.27 ; C7.1 19.56,22.37 C2.1 ; U6.9 18.13,36.23 19.56,36.23 ; 9.44,26.46 9.41,26.48 8.26,26.48 ; 9.44,26.46 9.44,24.09 ; 9.44,26.46 9.46,26.48 12.57,26.48 13.84,27.76 17.58,27.76 18.29,27.05 C16.2 19.56,27.07 C17.2 19.56,30.57 18.43,31.69 19.56,32.81 19.56,36.23 ; C1.2 19.56,17.33 C9.1 ; 9.44,24.09 9.24,23.9 8.38,23.9 ; 9.44,24.09 9.44,21.55 10.22,20.76 U2.16 ; 20.56,41.59 19.56,40.59 19.56,36.23 ; R7.2 24.07,17.66 23.68,17.27 25.71,17.27 ; U8.2 U9.2 23.76,11.08 24.57,11.89 24.57,14.03 25.15,14.61 26.17,14.61 26.92,15.37 26.92,16.76 26.42,17.27 25.71,17.27 ; C14.1 25.71,17.27 ; 19.56,36.23 23.79,36.23 24.44,35.58
  Top Layer w0.508: H4.18 0.83,44.89 0.83,6.54 H4.1 5.91,1.46 20.64,1.46 22.16,2.98 22.17,2.98 U8.2 ; U1.2 10.65,19.24 U2.16 ; C10.1 H5.4
  Bottom Layer w0.508: H3.1 29.53,52.77 H5.4 18.61,54.55 3.24,54.55 0.95,52.26 0.95,49.59 H4.18
BOOT0: length 16.2
  Top Layer w0.254: v1(21.27,37.78) 21.27,39.48 21.97,40.17 ; 25.58,30.92 25.58,30.43 25.21,30.06 BOOT0.2
  Bottom Layer w0.254: v1(21.27,37.78) 21.27,36.64 24.83,33.08 24.83,28.89 BOOT0.2
NRST: length 117.4
  Top Layer w0.254: H4.16 6.6,45.59 v1(6.6,48.51) 2.03,48.51 v1(0.7,47.18) ; 14.92,40.45 15.33,40.45 U6.7 ; R6.2 6.86,23.89 C11.2 6.79,21.08 6.79,11.75 U5.1
  Bottom Layer w0.254: U5.1 6.55,10.35 4.14,7.94 1.97,7.94 0.7,9.21 v1(0.7,47.18) ; 14.92,40.45 16.7,38.67 17.59,38.67 18.69,39.77 18.69,42.05 19.11,42.48 24.83,42.48 25.72,43.37 25.72,46.67 24.19,48.2 19.75,48.2 16.68,51.27 9.36,51.27 v1(6.6,48.51)
  vias: v1(15.05,40.58)
PA0: length 13.1
  Top Layer w0.254: U6.10 14.61,39.05 12.89,39.05 11.37,37.53 3.62,37.53 H4.14
PA1: length 13.6
  Top Layer w0.254: H4.13 5.78,37.15 11.49,37.15 13.02,38.67 14.28,38.67 14.9,38.05
PA2: length 13.6
  Top Layer w0.254: H4.12 7.94,36.77 13.61,36.77 U6.12
PA3: length 13.8
  Top Layer w0.254: 14.54,35.58 13.98,35.01 8.73,35.01 H4.11
PA4: length 16.3
  Top Layer w0.254: 14.9,35.22 14.33,34.66 8.88,34.66 4.51,30.29 4.51,28.26 H4.10
PA5: length 18.7
  Top Layer w0.254: H4.9 4.97,26.18 4.97,30.24 9.03,34.3 14.68,34.3 U6.15
PA6: length 21.2
  Top Layer w0.254: U6.16 14.93,33.85 9.08,33.85 5.4,30.16 5.4,24.07 H4.8
PA7: length 23.6
  Top Layer w0.254: H4.7 5.75,21.88 5.75,30.02 9.2,33.46 15.26,33.46 15.96,34.17
PA8: length 30.3
  Top Layer w0.254: 21.97,33.1 21.97,33.15 v1(20.51,34.61)
  Bottom Layer w0.254: H3.16 31.56,15.94 31.56,19.39 30.31,20.64 29.51,20.64 23.18,26.97 23.18,29.55 24.32,30.69 24.32,32.83 22.54,34.61 v1(20.51,34.61)
PA9/MCU_USART1_TX: length 31.7
  Top Layer w0.254: v1(17.84,23.3) U2.3 ; 22.32,33.46 22.92,32.86 v1(22.92,32.32)
  Bottom Layer w0.254: H3.15 29.91,16.99 29.82,17.08 23.21,17.08 18.02,22.27 18.02,22.57 17.84,22.75 v1(17.84,23.3) 17.84,27.24 18.54,27.94 18.54,28.3 18.26,28.57 18.26,28.93 18.98,29.65 19.34,29.65 19.62,29.37 19.98,29.37 20.69,30.09 20.69,30.45 20.42,30.73 20.42,31.09 21.14,31.81 21.5,31.81 21.77,31.53 22.13,31.53 v1(22.92,32.32)
PA10/MCU_USART1_RX: length 31.7
  Top Layer w0.254: v1(18.73,23.3) 18.73,22.42 18.35,22.03 U2.2 ; v1(23.56,31.81) 23.56,32.93 22.68,33.81
  Bottom Layer w0.254: H3.14 28.28,19.37 27.22,18.3 26.25,18.3 25.57,18.99 24.85,18.99 23.84,17.97 22.9,17.97 18.43,22.44 18.43,22.57 18.73,22.87 v1(18.73,23.3) 18.73,26.99 v1(23.56,31.81)
PA11: length 16.5
  Top Layer w0.254: H3.13 27.62,24.19 27.62,31.94 26.31,33.25 23.95,33.25 23.03,34.17
PA12: length 14
  Top Layer w0.254: H3.12 28,26.35 28,32.07 26.23,33.85 24.06,33.85 U6.33
PA13/JTMS/SWDIO: length 32.5
  Top Layer w0.254: v1(26.61,34.35) 24.26,34.35 23.74,34.87
  Bottom Layer w0.254: v1(26.61,34.35) 27.75,35.5 27.75,49.47 25.97,51.24 17.72,51.24 16.19,52.77 H5.2
PA14/JTCK/SWCLK: length 26.6
  Top Layer w0.254: U6.37 24.53,37.78 v1(26.1,37.78)
  Bottom Layer w0.254: v1(26.1,37.78) 26.1,46.86 24.39,48.58 19.88,48.58 16.83,51.63 13.91,51.63 H5.1
PA15: length 15.7
  Top Layer w0.254: H3.11 28.37,28.52 28.37,32.27 27.55,33.1 27.55,37.48 26.36,38.67 24.71,38.67 U6.38
PB0: length 24.3
  Top Layer w0.254: U6.18 14.57,32.07 v1(13.53,32.07)
  Bottom Layer w0.254: v1(13.53,32.07) 11.24,32.07 6.41,27.24 6.41,20 H4.6
PB1: length 26.8
  Top Layer w0.254: v1(13.53,31.18) 14.39,31.18 16.66,33.46
  Bottom Layer w0.254: H4.5 6.79,17.84 6.79,27.11 10.86,31.18 v1(13.53,31.18)
PB2/BOOT1: length 10.4
  Top Layer w0.254: U6.20 14.46,30.54 9.83,30.54 R1.2
PB3: length 14
  Top Layer w0.254: H3.10 28.73,30.71 28.73,32.42 27.9,33.25 27.9,37.63 26.48,39.05 24.38,39.05 23.74,38.41
PB4: length 12.2
  Top Layer w0.254: H3.9 28.26,33.72 28.26,37.79 26.61,39.43 24.06,39.43 U6.40
PB5: length 10.5
  Top Layer w0.254: H3.8 28.64,35.88 28.64,37.91 26.73,39.81 23.73,39.81 U6.41
PB6: length 8.8
  Top Layer w0.254: H3.7 26.86,40.2 23.4,40.2 U6.42
PB7: length 8.4
  Top Layer w0.254: 22.32,39.82 23.08,40.58 26.99,40.58 28,39.56 29.78,39.56 H3.6
PB8: length 9
  Top Layer w0.254: H3.5 27.88,42.23 26.97,41.32 22.41,41.32 U6.45
PB9: length 10.3
  Top Layer w0.254: U6.46 22.06,41.67 26.81,41.67 H3.4
PB10: length 29.5
  Top Layer w0.254: 17.37,32.75 14.4,29.78 v1(13.53,29.78)
  Bottom Layer w0.254: H4.4 7.15,15.66 7.15,26.96 9.97,29.78 v1(13.53,29.78)
PB11: length 31.9
  Top Layer w0.254: 17.73,32.4 14.35,29.02 v1(13.53,29.02)
  Bottom Layer w0.254: v1(13.53,29.02) 9.72,29.02 7.51,26.81 7.51,13.47 H4.3
PB12: length 32.1
  Top Layer w0.254: H3.20 27.45,6.59 27.45,17.38 26.35,18.48 25.21,18.48 24.83,18.86 24.83,20.38 23.75,21.46 23.75,25.78 22.16,27.37 22.16,30.08 20.56,31.69
PB13: length 29.1
  Top Layer w0.254: 20.91,32.04 22.54,30.41 22.54,27.49 27.81,22.23 27.81,8.77 H3.19
PB14: length 26.8
  Top Layer w0.254: 21.26,32.4 22.9,30.76 22.9,27.64 28.16,22.39 28.16,10.95 H3.18
PB15: length 24.4
  Top Layer w0.254: H3.17 28.52,13.14 28.52,22.54 23.26,27.79 23.26,31.11 21.62,32.75
PC13/LED(B): length 54.9
  Top Layer w0.254: 18.08,41.23 18.73,40.58 v1(18.73,37.15) ; v1(22.61,12.95) 22.67,13.02 R4.2 ; v1(21.15,43.12) 18.22,43.12 17.58,42.48 17.58,41.73 U6.2
  Bottom Layer w0.254: H4.15 5.78,37.15 v1(18.73,37.15) 18.73,30.92 16.7,28.89 16.7,18.86 v1(22.61,12.95)
PC14/RCC_OSC32_IN: length 10.7
  Top Layer w0.254: X1.2 22.76,43.8 C19.2 18.4,43.8 17.08,42.48 17.08,41.53 17.73,40.88
PC15/RCC_OSC32_OUT: length 10.7
  Top Layer w0.254: 17.37,40.53 16.57,41.33 16.57,42.74 17.37,43.53 17.37,44.42 18.54,45.59 C20.2 22.95,45.59 X1.1
PD0/RCC_OSC_IN: length 8.3
  Top Layer w0.254: U6.5 15.44,41.75 C15.2 15.44,47.82 U7.2
PD1/RCC_OSC_OUT: length 8.3
  Top Layer w0.254: U6.6 15.03,41.45 C18.2 14.01,41.46 U7.1
$1N7601: length 3.2
  Top Layer w0.381: U8.1 25.36,1.43 R3.1
$1N7627: length 4
  Top Layer w0.254: U9.1 25.36,12.98 25.33,13.02
$1N8327: length 36.1
  Top Layer w0.254: v1(16.63,3.44) 16.63,6.43 U3.3 ; v1(14.54,25.84) U2.5
  Bottom Layer w0.254: v1(14.54,25.84) 11.31,25.84 9.87,24.41 9.87,20.58 10.35,20.1 10.35,19.06 9.87,18.57 9.87,17.53 10.35,17.05 10.35,16.01 9.87,15.52 9.87,14.68 12.26,12.3 12.26,9.23 13.14,8.34 15.45,8.34 16.63,7.17 v1(16.63,3.44)
$1N8354: length 36.2
  Top Layer w0.254: U2.6 16.27,26.99 v1(14.54,26.99) ; U3.2 15.87,6.43 v1(15.87,3.44)
  Bottom Layer w0.254: v1(15.87,3.44) 15.87,7.35 15.28,7.94 12.98,7.94 11.85,9.06 11.85,12.13 9.46,14.52 9.46,24.57 11.87,26.99 v1(14.54,26.99)
$1N13397: length 2.3
  Top Layer w0.254: R7.1 25.58,21.54 BOOT0.1
$1N13854: length 12.9
  Top Layer w0.508: U1.3 9.59,17.32 C3.1 C4.1 14.55,13.97 U4.1 14.57,9.5

## Copper pours and planes (outline as drawn; the poured copper is in the pictures)
GND on Top Layer: -1.52,57.6 34.16,57.6 34.16,-1.27 -1.52,-1.27
GND on Bottom Layer: -1.52,58.04 34.67,58.04 34.67,-1.27 -1.52,-1.27

Small or netless copper shapes (teardrops, artwork), in the pictures only: 176 on Top Layer, 47 on Bottom Layer

## Text on the board
Bottom Silkscreen Layer: A15 | VBAT | G | VCC | RST | B9 | B8 | B7 | B6 | B5 | B4 | B3 | A12 | A11 | A10 | A9 | A8 | B15 | B14 | B13 | B12 | 5V | C13 | A0 | A1 | A2 | A3 | A4 | A5 | A6 | A7 | B0 | B1 | B10 | B11 | SWCLK | SWDIO | GND | 3.3V | Made by Star
Top Silkscreen Layer: H5 | VBAT | G | VCC | RST | C13 | A0 | A1 | A2 | A3 | A4 | A5 | A6 | A7 | B0 | B1 | B10 | B11 | 5V | B9 | B8 | B7 | B6 | B5 | B4 | B3 | A11 | A10 | A9 | A8 | B15 | B14 | B13 | B12 | A12 | SWC | SWD | 3.3V | A15 | Power | PC13
